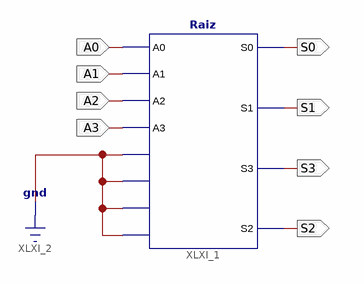
[diagram p0: schematic sheet 1]
// Xilinx ISE schematic pruebaRaiz.sch (spartan3e) as structural Verilog: 1 symbols, 8 ports
module pruebaRaiz (
  input  A0,
  input  A1,
  input  A2,
  input  A3,
  output S0,
  output S1,
  output S3,
  output S2
);

  Raiz XLXI_1 (
    .A0(A0), .A1(A1), .A2(A2), .A3(A3), .A4(1'b0), .A5(1'b0), .A6(1'b0), .A7(1'b0), .S0(S0), .S1(S1),
    .S3(S3), .S2(S2));
endmodule
